# EAGLE design pi-radio (EAGLE 6.4)
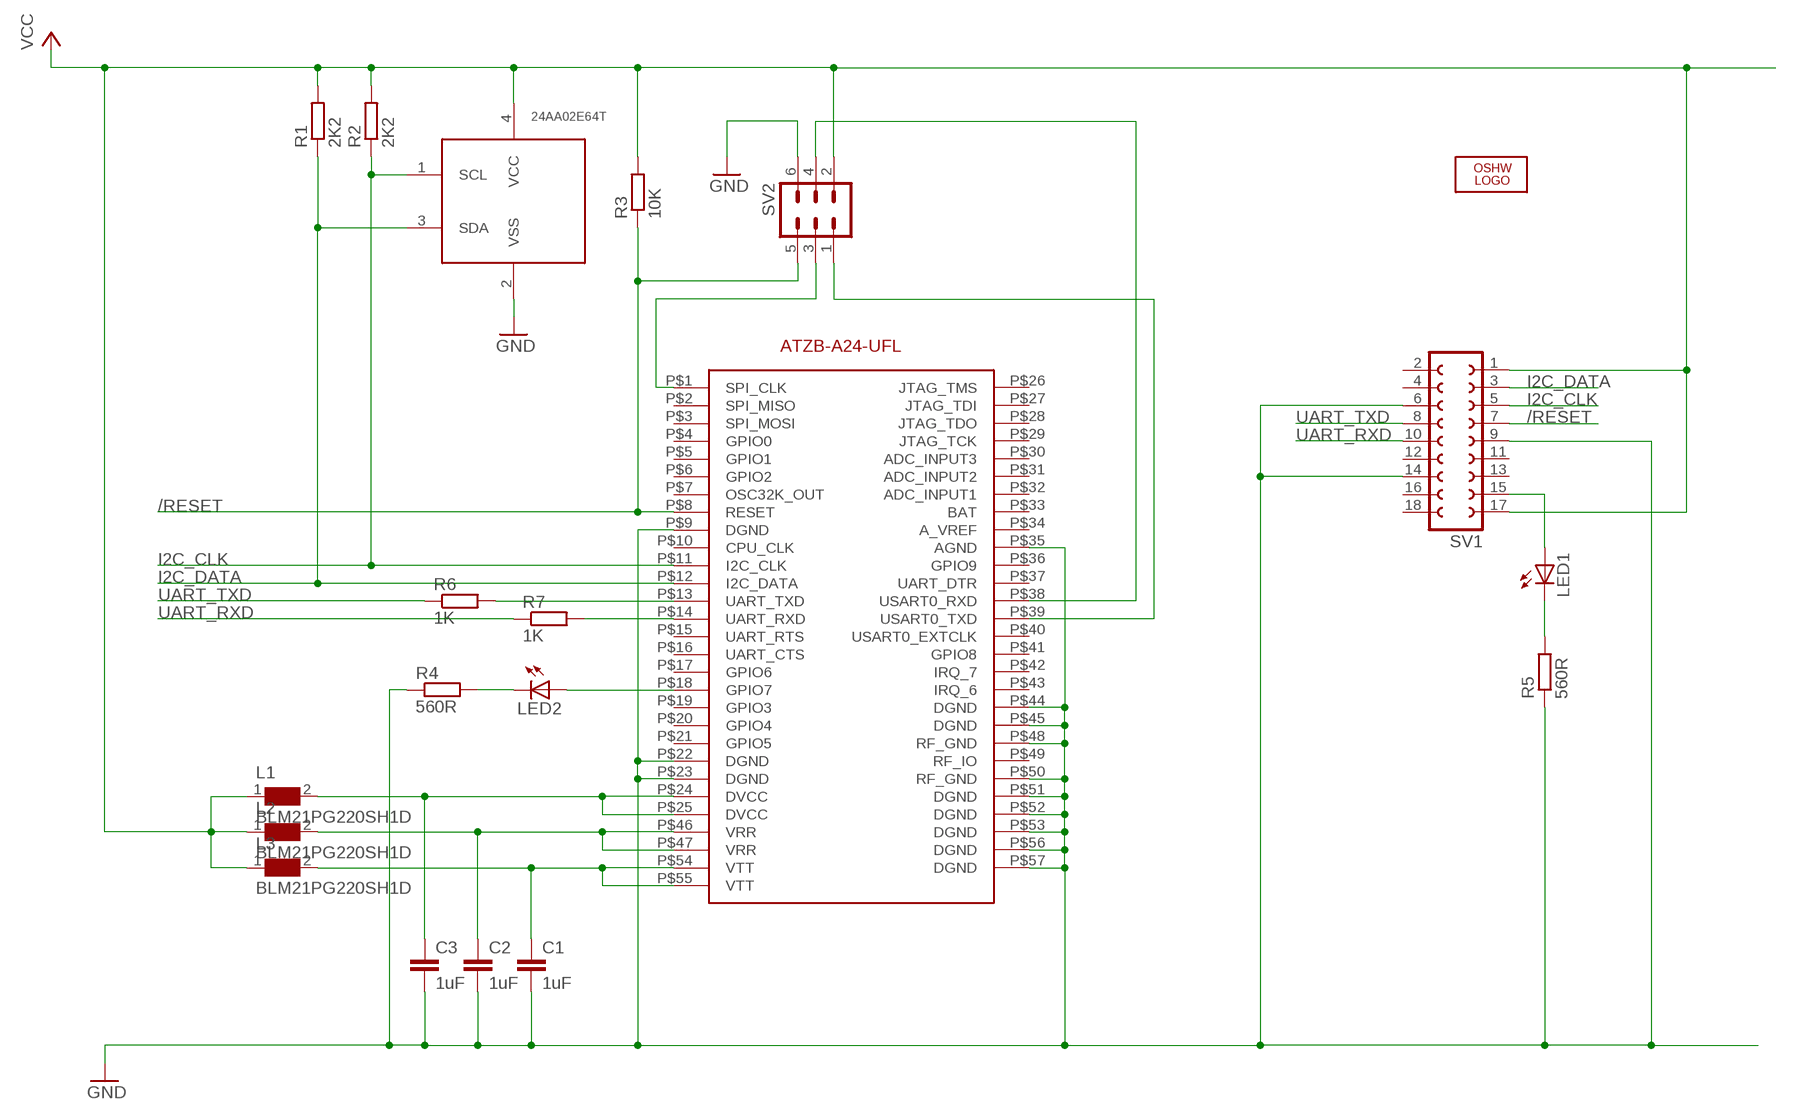
[diagram p0: schematic, sheet 1]

## Parts
C1  1uF  C-EUC0603  [C0603]
C2  1uF  C-EUC0603  [C0603]
C3  1uF  C-EUC0603  [C0603]
L1  BLM21PG220SH1D  WE-CBF_0805  [0805]
L2  BLM21PG220SH1D  WE-CBF_0805  [0805]
L3  BLM21PG220SH1D  WE-CBF_0805  [0805]
LED1  LEDSML0805  [SML0805]
LED2  LEDSML0805  [SML0805]
LOGO1  OSHW_LOGO_8MILX0100-NT  [OSHW_8X100_NOTEXT]
R1  2K2  R-EU_R0603  [R0603]
R2  2K2  R-EU_R0603  [R0603]
R3  10K  R-EU_R0603  [R0603]
R4  560R  R-EU_R0603  [R0603]
R5  560R  R-EU_R0603  [R0603]
R6  1K  R-EU_R0603  [R0603]
R7  1K  R-EU_R0603  [R0603]
SV1  FE09-2  [FE09-2]
SV2  MA03-2  [MA03-2]
U$1  ATZB-A24-UFL  [ATZB-A24-UFL]
U$2  24AA02E64T  [SOT23-5L]

## Nets
/RESET: R3.1 SV1.7 SV2.5 U$1.P$8(RESET)
GND: C1.2 C2.2 C3.2 R4.1 R5.1 SV1.6 SV1.9 SV1.14 SV2.6 U$1.P$9(DGND) U$1.P$22(DGND) U$1.P$23(DGND) U$1.P$35(AGND) U$1.P$44(DGND) U$1.P$45(DGND) U$1.P$48(RF_GND) U$1.P$50(RF_GND) U$1.P$51(DGND) U$1.P$52(DGND) U$1.P$53(DGND) U$1.P$56(DGND) U$1.P$57(DGND) U$2.2(VSS)
I2C_CLK: R2.1 SV1.5 U$1.P$11(I2C_CLK) U$2.1(SCL)
I2C_DATA: R1.1 SV1.3 U$1.P$12(I2C_DATA) U$2.3(SDA)
N$1: LED1.A SV1.15
N$2: LED2.A U$1.P$18(GPIO7)
N$3: C1.1 L3.2 U$1.P$54(VTT) U$1.P$55(VTT)
N$4: C2.1 L2.2 U$1.P$46(VRR) U$1.P$47(VRR)
N$5: C3.1 L1.2 U$1.P$24(DVCC) U$1.P$25(DVCC)
N$6: LED2.C R4.2
N$7: LED1.C R5.2
N$8: SV2.1 U$1.P$39(USART0_TXD)
N$9: SV2.4 U$1.P$38(USART0_RXD)
N$12: R7.2 U$1.P$14(UART_RXD)
N$13: R6.2 U$1.P$13(UART_TXD)
SPI_CLK: SV2.3 U$1.P$1(SPI_CLK)
UART_RXD: R7.1 SV1.10
UART_TXD: R6.1 SV1.8
VCC: L1.1 L2.1 L3.1 R1.2 R2.2 R3.2 SV1.1 SV1.17 SV2.2 U$2.4(VCC)
Unconnected: SV1.2 SV1.4 SV1.11 SV1.12 SV1.13 SV1.16 SV1.18 U$1.P$2(SPI_MISO) U$1.P$3(SPI_MOSI) U$1.P$4(GPIO0) U$1.P$5(GPIO1) U$1.P$6(GPIO2) U$1.P$7(OSC32K_OUT) U$1.P$10(CPU_CLK) U$1.P$15(UART_RTS) U$1.P$16(UART_CTS) U$1.P$17(GPIO6) U$1.P$19(GPIO3) U$1.P$20(GPIO4) U$1.P$21(GPIO5) U$1.P$26(JTAG_TMS) U$1.P$27(JTAG_TDI) U$1.P$28(JTAG_TDO) U$1.P$29(JTAG_TCK) U$1.P$30(ADC_INPUT3) U$1.P$31(ADC_INPUT2) U$1.P$32(ADC_INPUT1) U$1.P$33(BAT) U$1.P$34(A_VREF) U$1.P$36(GPIO9) U$1.P$37(UART_DTR) U$1.P$40(USART0_EXTCLK) U$1.P$41(GPIO8) U$1.P$42(IRQ_7) U$1.P$43(IRQ_6) U$1.P$49(RF_IO)

## Library data of the parts
C1-C3 = resistor:C-EU: CAPACITOR, European symbol
L1-L3 = EagleLibrary_Wuerth_Elektronik_eiSos_Version_6:WE-CBF: SMD EMI Suppression Ferrite Beads WE-CBF - Excellent anti-EMI properties - Low DC-restistance - Impedances till 3000 ohms - Rated current up to 6 A -- Reliable Ni-Sn electrodes -- Perfect as data lined filter and for uncoupling of distribution voltage
LED1 LED2 = led:LED: LED OSRAM: - CHIPLED LG R971, LG N971, LY N971, LG Q971, LY Q971, LO R971, LY R971 LH N974, LH R974 LS Q976, LO Q976, LY Q976 LO Q996 - Hyper CHIPLED LW Q18S LB Q993, LB Q99A, LB R99A - SideLED LS A670, LO A670, LY A670, LG A670, LP A670 LB A673, LV A673, LT A673, LW A673 LH A674 LY A675 LS A676, LA A676, LO A676, LY A676, LW A676 LS A679, LY A679, LG A679 - Hyper Micro SIDELED® LS Y876, LA Y876, LO Y876, LY Y876 LT Y87S - SmartLED LW L88C, LW L88S LB L89C, LB L89S, LG L890 LS L89K, LO L89K, LY L89K LS L896, LA L896, LO L896, LY L896 - TOPLED LS T670, LO T670, LY T670, LG T670, LP T670 LSG T670, LSP T670, LSY T670, LOP T670, LYG T670 LG T671, LOG T671, LSG T671 LB T673, LV T673, LT T673, LW T673 LH T674 LS T676, LA T676, LO T676, LY T676, LB T676, LH T676, LSB T676, LW T676 LB T67C, LV T67C, LT T67C, LS T67K, LO T67K, LY T67K, LW E67C LS E67B, LA E67B, LO E67B, LY E67B, LB E67C, LV E67C, LT E67C LW T67C LS T679, LY T679, LG T679 LS T770, LO T770, LY T770, LG T770, LP T770 LB T773, LV T773, LT T773, LW T773 LH T774 LS E675, LA E675, LY E675, LS T675 LS T776, LA T776, LO T776, LY T776, LB T776 LHGB T686 LT T68C, LB T68C - Hyper Mini TOPLED® LB M676 - Mini TOPLED Santana® LG M470 LS M47K, LO M47K, LY M47K Source: http://www.osram.convergy.de LUXEON: - LUMILED® LXK2-PW12-R00, LXK2-PW12-S00, LXK2-PW14-U00, LXK2-PW14-V00 LXK2-PM12-R00, LXK2-PM12-S00, LXK2-PM14-U00 LXK2-PE12-Q00, LXK2-PE12-R00, LXK2-PE12-S00, LXK2-PE14-T00, LXK2-PE14-U00 LXK2-PB12-K00, LXK2-PB12-L00, LXK2-PB12-M00, LXK2-PB14-N00, LXK2-PB14-P00, LXK2-PB14-Q00 LXK2-PR12-L00, LXK2-PR12-M00, LXK2-PR14-Q00, LXK2-PR14-R00 LXK2-PD12-Q00, LXK2-PD12-R00, LXK2-PD12-S00 LXK2-PH12-R00, LXK2-PH12-S00 LXK2-PL12-P00, LXK2-PL12-Q00, LXK2-PL12-R00 Source: www.luxeon.com KINGBRIGHT: KA-3528ASYC Source: www.kingbright.com
LOGO1 = ohw-logo:OSHW_LOGO_8MIL
R1-R7 = resistor:R-EU_: RESISTOR, European symbol
SV1 = con-lsta:FE09-2: FEMALE HEADER; OC_FARNELL: unknown; OC_NEWARK: unknown
SV2 = con-lstb:MA03-2: PIN HEADER; OC_FARNELL: unknown; OC_NEWARK: unknown
U$1 = __SR:ATZB-A24-UFL
U$2 = __SR:24AA02E64T

## Board
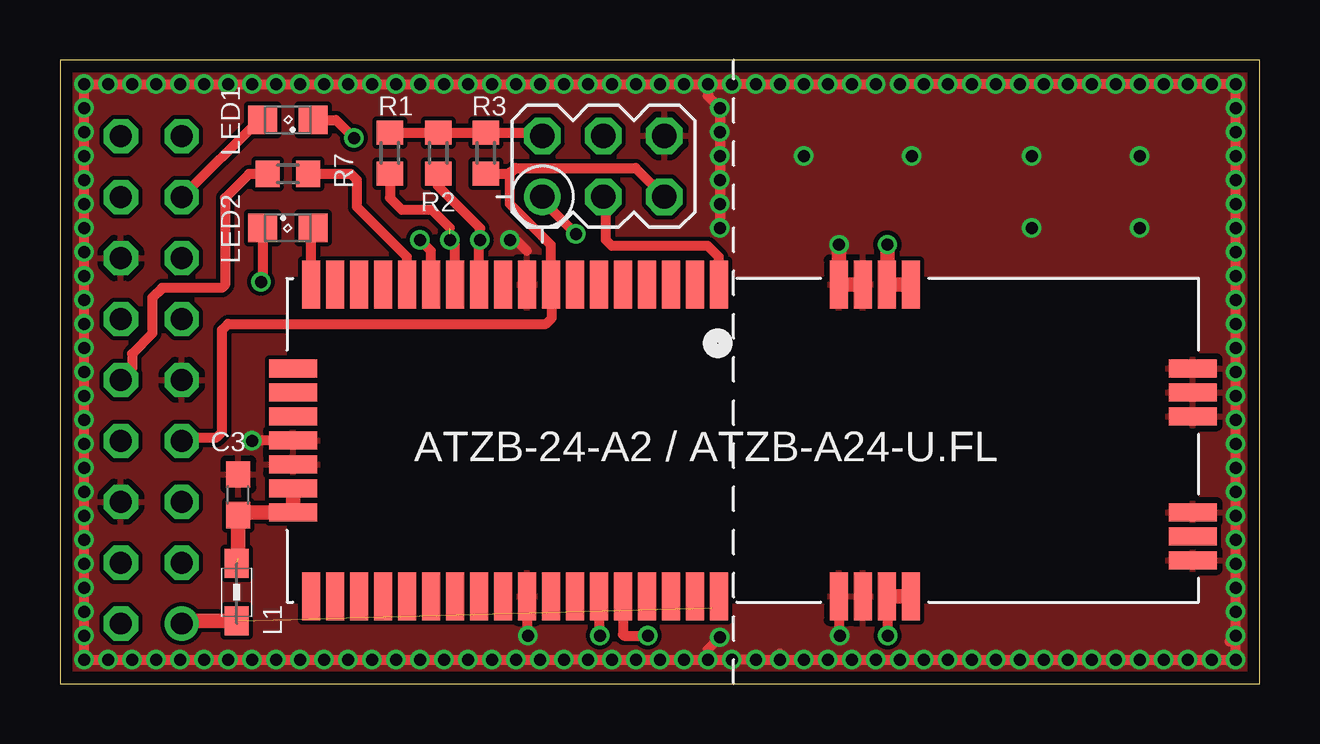
[diagram p1: board, top side]
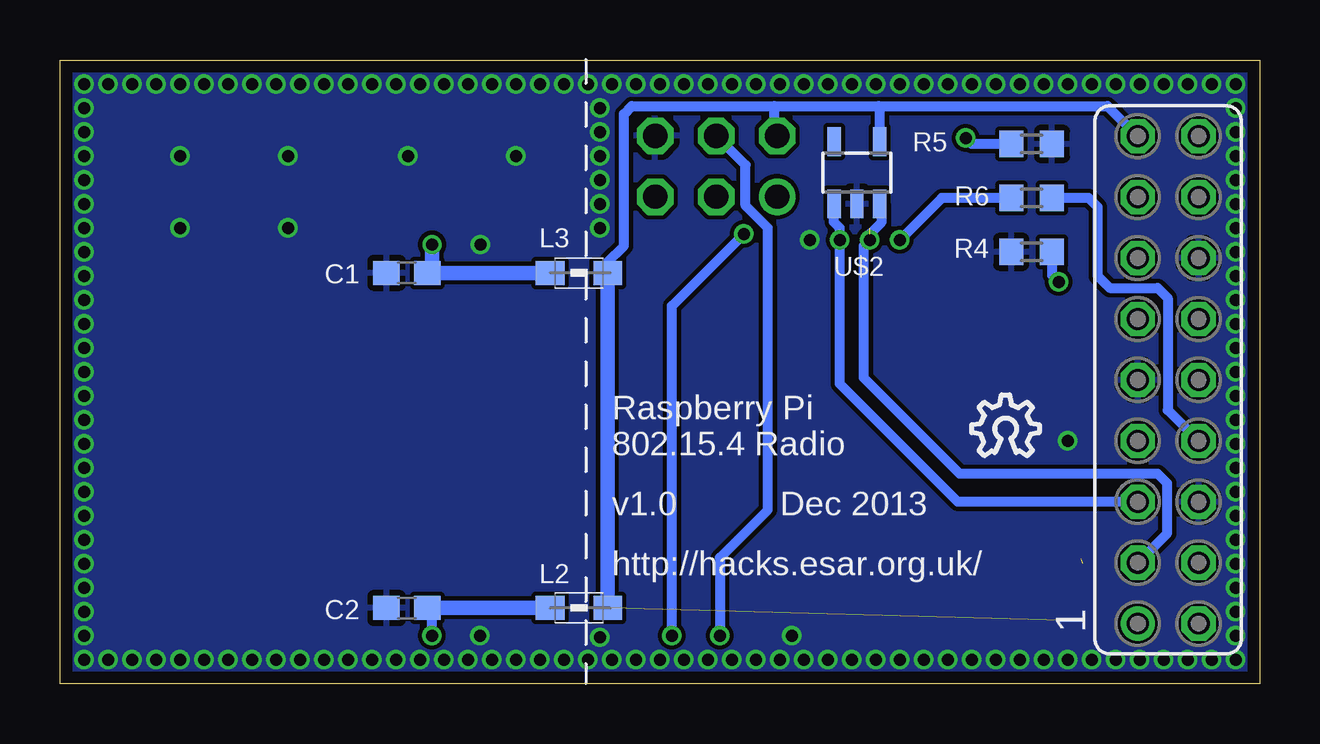
[diagram p2: board, bottom side, seen from below]

Size 50 x 26 mm. Coordinates in mm from the lower left corner, seen from the top.
Outline: 0,0 50,0 50,26 0,26 0,0
Copper layers (1*16): Top 0.035mm / dielectric 1.5mm / Bottom 0.035mm
Design rules "EagleRules *": minimum track width 7mil, minimum drill 12mil, track to track 7mil, track to pad 7mil, pad to pad 7mil, via to via 7mil, smd to smd 0mil, copper to edge 20mil, drill to drill 10mil, minimum pad ring 10mil, minimum via ring 6mil, stop-mask expansion 2mil, vias tented up to drill 25mil, thermal gap 10mil

### Footprints (pad centres in the part's own frame; a part is rotated, then mirrored left to right if it is on the bottom)
C0603 = smd 1.1 x 1: 1 -0.85,0; 2 0.85,0
0805 = smd 1.2 x 1: 1 -1.2,0; 2 1.2,0
SML0805 = smd 1.2 x 1.2: A 1.05,0; C -1.05,0
R0603 = smd 1 x 1.1: 1 -0.85,0; 2 0.85,0
FE09-2 = drill 0.914: 1 -10.16,1.27 | drill 0.914 octagon: 2 -10.16,-1.27; 3 -7.62,1.27; 4 -7.62,-1.27; 5 -5.08,1.27; 6 -5.08,-1.27; 7 -2.54,1.27; 8 -2.54,-1.27; 9 0,1.27; 10 0,-1.27; 11 2.54,1.27; 12 2.54,-1.27; 13 5.08,1.27; 14 5.08,-1.27; 15 7.62,1.27; 16 7.62,-1.27; 17 10.16,1.27; 18 10.16,-1.27
MA03-2 = drill 1.016: 1 -2.54,-1.27 | drill 1.016 octagon: 2 -2.54,1.27; 3 0,-1.27; 4 0,1.27; 5 2.54,-1.27; 6 2.54,1.27
ATZB-A24-UFL = smd 0.75 x 2: P$1 -1,6.5; P$2 -2,6.5; P$3 -3,6.5; P$4 -4,6.5; P$5 -5,6.5; P$6 -6,6.5; P$7 -7,6.5; P$8 -8,6.5; P$9 -9,6.5; P$10 -10,6.5; P$11 -11,6.5; P$12 -12,6.5; P$13 -13,6.5; P$14 -14,6.5; P$15 -15,6.5; P$16 -16,6.5; P$17 -17,6.5; P$18 -18,6.5; P$26 -18,-6.5; P$27 -17,-6.5; P$28 -16,-6.5; P$29 -15,-6.5; P$30 -14,-6.5; P$31 -13,-6.5; P$32 -12,-6.5; P$33 -11,-6.5; P$34 -10,-6.5; P$35 -9,-6.5; P$36 -8,-6.5; P$37 -7,-6.5; P$38 -6,-6.5; P$39 -5,-6.5; P$40 -4,-6.5; P$41 -3,-6.5; P$42 -2,-6.5; P$43 -1,-6.5; P$44 4,-6.5; P$45 5,-6.5; P$46 6,-6.5; P$47 7,-6.5; P$54 7,6.5; P$55 6,6.5; P$56 5,6.5; P$57 4,6.5 | smd 2 x 0.75: P$19 -18.75,3; P$20 -18.75,2; P$21 -18.75,1; P$22 -18.75,0; P$23 -18.75,-1; P$24 -18.75,-2; P$25 -18.75,-3; P$48 18.75,-5; P$49 18.75,-4; P$50 18.75,-3; P$51 18.75,1; P$52 18.75,2; P$53 18.75,3
SOT23-5L = smd 0.55 x 1.2: 1 -0.95,-1.3; 2 0,-1.3; 3 0.95,-1.3; 4 0.95,1.3; 5 -0.95,1.3

### Placement (x,y rotation side)
C1  35.54,17.12 180 bottom
C2  35.54,3.15 180 bottom
C3  7.43,7.87 90 top
L1  7.37,3.81 90 top
L2  28.37,3.15 180 bottom
L3  28.37,17.12 180 bottom
LED1  9.5,23.5 180 top
LED2  9.5,19 0 top
LOGO1  12,9.5 0 bottom
R1  13.75,22.12 90 top
R2  15.77,22.12 90 top
R3  17.75,22.12 90 top
R4  9.5,18 0 bottom
R5  9.5,22.5 180 bottom
R6  9.5,20.25 180 bottom
R7  9.5,21.25 0 top
SV1  3.81,12.66 90 bottom
SV2  22.65,21.57 0 top
U$1  28.46,10.14 0 top
U$2  16.78,21.3 0 bottom

### Tracks (layer width: path | path; a pad name or v marks a point on that pad's centre or on a via)
/RESET
  Top 0.406: SV2.5 23.99,21.5 19,21.5 18.81,21.31 18.75,21.31 | 18.75,21.31 18.75,20 20.46,18.29 U$1.P$8 20.5,16.6 20.5,15.25 20.25,15 7,15 6.75,14.75 6.75,10.5 6.5,10.25 5.21,10.25 SV1.7 | R3.1 18.71,21.27 18.75,21.31
GND  (via drill 0.5)
  Top 0.406: v27,1 v26,1 v25,1 v24,1 v23,1 v22,1 v21,1 v20,1 v19,1 v18,1 v17,1 v16,1 v15,1 v14,1 v13,1 v12,1 v11,1 v10,1 v9,1 v8,1 v7,1 v6,1 v1,1 v1,2 v1,3 v1,4 v1,5 v1,6 v1,7 v1,8 v1,9 v1,10 v1,11 v1,12 v1,13 v1,14 v1,15 v1,16 v1,17 v1,18 v1,19 v1,20 v1,21 v1,22 v1,23 v1,24 v1,25 v2,25 v3,25 v4,25 v5,25 v6,25 v7,25 v8,25 v9,25 v10,25 v11,25 v12,25 v13,25 v14,25 v15,25 v16,25 v17,25 v18,25 v19,25 v20,25 v21,25 v22,25 v23,25 v24,25 v25,25 v26,25 v27,25 | v27,1 v28,1 v29,1 v30,1 | v30,1 v31,1 v32,1 v33,1 v34,1 v35,1 v36,1 v37,1 v38,1 v39,1 v40,1 v41,1 v42,1 v43,1 v44,1 v45,1 v46,1 v47,1 v48,1 v49,1 v49,2 | v27,25 v28,25 v29,25 v30,25 v31,25 v32,25 v33,25 v34,25 | v49,2 v49,3 v49,4 v49,5 v49,6 v49,7 v49,8 v49,9 v49,10 v49,11 v49,12 v49,13 v49,14 v49,15 v49,16 v49,17 v49,18 v49,19 v49,20 v49,21 v49,22 v49,23 v49,24 v49,25 v48,25 v47,25 v46,25 v45,25 v44,25 v43,25 v42,25 v41,25 v40,25 v39,25 v38,25 v37,25 v36,25 v35,25 | v30,1 30,1.25 | v27.5,19 v27.5,20 v27.5,21 v27.5,22 v27.5,23 v27.5,24 27,24.5 v27,25 | 19.46,18.04 19,18.5 v18.75,18.5 | 48.75,1.75 v49,2 | U$1.P$22 8.02,10.14 v8,10.12 | U$1.P$35 19.46,2.04 v19.5,2 | U$1.P$44 32.46,2.04 v32.5,2 | v27,1 27,1.43 v27.5,1.93
  Top 0.61: U$1.P$56 U$1.P$57 32.46,18.29 v32.48,18.3
  other vias: 2,1 3,1 4,1 5,1 31,22 35.5,22 40.5,22 45,22 40.5,19 45,19
  pour Bottom: 0,0 0,26 50,26 50,0
  pour Top: 0,0 0,26 50,26 50,0
I2C_CLK  (via drill 0.5)
  Top 0.406: U$1.P$11 17.46,18.46 v17.5,18.5 17.52,18.52 17.52,18.98 15.75,20.75 15.75,21.25 R2.1
  Bottom 0.406: U$2.1 17.75,19.98 17.75,19.25 17.5,19 v17.5,18.5 17.5,12.5 12.58,7.58 SV1.5
I2C_DATA  (via drill 0.5)  (1 unrouted)
  Top 0.406: U$1.P$12 16.46,18.29 v16.25,18.5 | 16.25,19 15.5,19.75 14.25,19.75 13.75,20.25 R1.1
  Bottom 0.406: U$2.3 15.75,19.92 15.75,19.25 16.25,18.75 v16.25,18.5 16.5,18.25 16.5,12.75 12.5,8.75 4.25,8.75 3.85,8.35 3.85,6.27 SV1.3
N$1
  Top 0.406: LED1.A 8.3,23.5 SV1.15
N$2
  Top 0.406: U$1.P$18 10.46,18.91 LED2.A
N$3  (via drill 0.5)
  Top 0.61: v34.49,18.3 34.49,16.64 U$1.P$55 U$1.P$54
  Bottom 0.61: L3.2 C1.1 34.49,17.32 v34.49,18.3
N$4  (via drill 0.5)
  Top 0.406: 35.45,3.2 35.5,3.25 35.5,3.6 U$1.P$47 | 34.49,3.2 v34.49,2.01 v34.5,2
  Top 0.61: 34.49,3.2 34.49,3.64 U$1.P$46 U$1.P$47
  Bottom 0.406: v34.5,2 34.5,2.96 C2.1
  Bottom 0.61: L2.2 C2.1
N$5  (1 unrouted)
  Top 0.61: U$1.P$24 U$1.P$25 7.57,7.14 7.43,7 | C3.1 7.43,7 | 7.43,7 7.43,5.2
N$6  (via drill 0.5)
  Top 0.406: LED2.C 8.45,16.82 v8.38,16.75
  Bottom 0.406: R4.2 8.65,17.02 v8.38,16.75
N$7  (via drill 0.5)
  Top 0.406: LED1.C 11.5,23.5 v12.25,22.75
  Bottom 0.406: R5.2 12,22.5 v12.25,22.75
N$8  (via drill 0.5)
  Top 0.406: U$1.P$39 23.46,2.04 23.5,2 v24.5,2 | SV2.1 20.11,20.14 v21.5,18.75
  Bottom 0.406: v21.5,18.75 24.5,15.75 v24.5,2
N$9  (via drill 0.5)
  Top 0.406: U$1.P$38 22.46,2.04 v22.5,2
  Bottom 0.406: v22.5,2 22.5,5.25 20.5,7.25 20.5,19 21.43,19.93 21.43,21.61 SV2.4
N$12
  Top 0.406: U$1.P$14 14.46,17.79 12.38,19.88 12.38,21 12.12,21.25 R7.2
N$13  (via drill 0.5)
  Top 0.406: U$1.P$13 15.46,18.04 v15,18.5
  Bottom 0.406: R6.2 13.25,20.25 v15,18.5
SPI_CLK
  Top 0.406: U$1.P$1 27.46,17.79 27,18.25 23,18.25 22.75,18.5 22.75,20.2 SV2.3
UART_RXD
  Top 0.406: SV1.10 3,13.12 3,13.75 3.85,14.6 3.85,16.1 4.25,16.5 6.75,16.5 6.88,16.62 6.88,20.25 7.88,21.25 R7.1
UART_TXD
  Bottom 0.406: R6.1 7.12,20.25 6.75,19.88 6.75,17 6.25,16.5 4.25,16.5 3.83,16.07 3.83,11.4 SV1.8
VCC  (1 unrouted)
  Top 0.406: SV2.2 19.98,22.97 R3.2 R2.2 R1.2
  Top 0.61: L1.1 5.19,2.61 SV1.1
  Bottom 0.406: SV1.17 6.33,24.07 15.88,24.07 | L3.1 27.17,17.58 26.5,18.25 26.5,23.75 26.18,24.07 20.23,24.07 | 20.23,24.07 15.88,24.07 | U$2.4 15.83,24.03 15.88,24.07 | 20.23,24.07 20.23,22.86 20.12,22.75 20.12,22.82 SV2.2
  Bottom 0.61: L2.1 L3.1

### Text on the board
tPlace: ATZB-24-A2 / ATZB-A24-U.FL
bPlace: Raspberry Pi | 802.15.4 Radio | Dec 2013 | v1.0 | http://hacks.esar.org.uk/